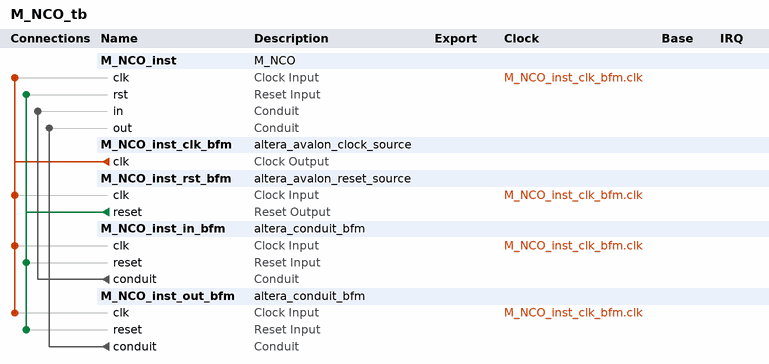
[diagram p0: system contents]
# Platform Designer (Qsys) system M_NCO_tb, MAX 10 10M40DAF256C8G
# Parameters at their usual value, and those the tool derives, are not listed.
package require -exact qsys 17.1
create_system M_NCO_tb
set_project_property DEVICE_FAMILY {MAX 10}
set_project_property DEVICE 10M40DAF256C8G

add_instance M_NCO_inst M_NCO 1.0

add_instance M_NCO_inst_clk_bfm altera_avalon_clock_source 17.1

add_instance M_NCO_inst_rst_bfm altera_avalon_reset_source 17.1
set_instance_parameter_value M_NCO_inst_rst_bfm ASSERT_HIGH_RESET 0
set_instance_parameter_value M_NCO_inst_rst_bfm INITIAL_RESET_CYCLES 50

add_instance M_NCO_inst_in_bfm altera_conduit_bfm 17.1
set_instance_parameter_value M_NCO_inst_in_bfm CLOCKED_SIGNAL true
set_instance_parameter_value M_NCO_inst_in_bfm ENABLE_RESET true
set_instance_parameter_value M_NCO_inst_in_bfm SIGNAL_DIRECTIONS output,output
set_instance_parameter_value M_NCO_inst_in_bfm SIGNAL_ROLES clken,phi_inc_i
set_instance_parameter_value M_NCO_inst_in_bfm SIGNAL_WIDTHS 1,32

add_instance M_NCO_inst_out_bfm altera_conduit_bfm 17.1
set_instance_parameter_value M_NCO_inst_out_bfm CLOCKED_SIGNAL true
set_instance_parameter_value M_NCO_inst_out_bfm ENABLE_RESET true
set_instance_parameter_value M_NCO_inst_out_bfm SIGNAL_DIRECTIONS input,input
set_instance_parameter_value M_NCO_inst_out_bfm SIGNAL_ROLES fsin_o,out_valid
set_instance_parameter_value M_NCO_inst_out_bfm SIGNAL_WIDTHS 18,1

# connections
add_connection M_NCO_inst_clk_bfm.clk M_NCO_inst.clk clock
add_connection M_NCO_inst_clk_bfm.clk M_NCO_inst_in_bfm.clk clock
add_connection M_NCO_inst_clk_bfm.clk M_NCO_inst_out_bfm.clk clock
add_connection M_NCO_inst_clk_bfm.clk M_NCO_inst_rst_bfm.clk clock
add_connection M_NCO_inst_rst_bfm.reset M_NCO_inst.rst reset
add_connection M_NCO_inst_rst_bfm.reset M_NCO_inst_in_bfm.reset reset
add_connection M_NCO_inst_rst_bfm.reset M_NCO_inst_out_bfm.reset reset
add_connection M_NCO_inst_in_bfm.conduit M_NCO_inst.in conduit
add_connection M_NCO_inst_out_bfm.conduit M_NCO_inst.out conduit

set_interconnect_requirement {$system} qsys_mm.clockCrossingAdapter HANDSHAKE
set_interconnect_requirement {$system} qsys_mm.enableEccProtection FALSE
set_interconnect_requirement {$system} qsys_mm.insertDefaultSlave FALSE
set_interconnect_requirement {$system} qsys_mm.maxAdditionalLatency 1

save_system M_NCO_tb.qsys
